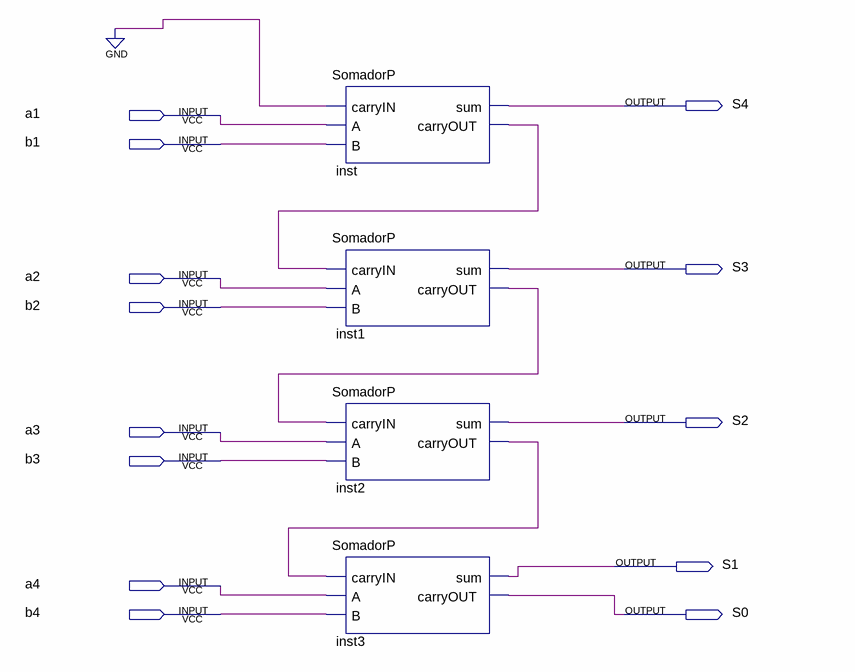
[diagram p0: schematic sheet]
// Quartus schematic SOMADOR.bdf as structural Verilog: 4 symbols, 13 pins
module SOMADOR (
  input  a1,
  input  b1,
  input  a2,
  input  b2,
  input  a3,
  input  b3,
  input  a4,
  input  b4,
  output S4,
  output S3,
  output S2,
  output S1,
  output S0
);

  wire inst1_carryout, inst2_carryout, inst_carryout;

  SomadorP inst (.carryIN(1'b0), .A(a1), .B(b1), .sum(S4), .carryOUT(inst_carryout));
  SomadorP inst1 (.carryIN(inst_carryout), .A(a2), .B(b2), .sum(S3), .carryOUT(inst1_carryout));
  SomadorP inst2 (.carryIN(inst1_carryout), .A(a3), .B(b3), .sum(S2), .carryOUT(inst2_carryout));
  SomadorP inst3 (.carryIN(inst2_carryout), .A(a4), .B(b4), .sum(S1), .carryOUT(S0));
endmodule
